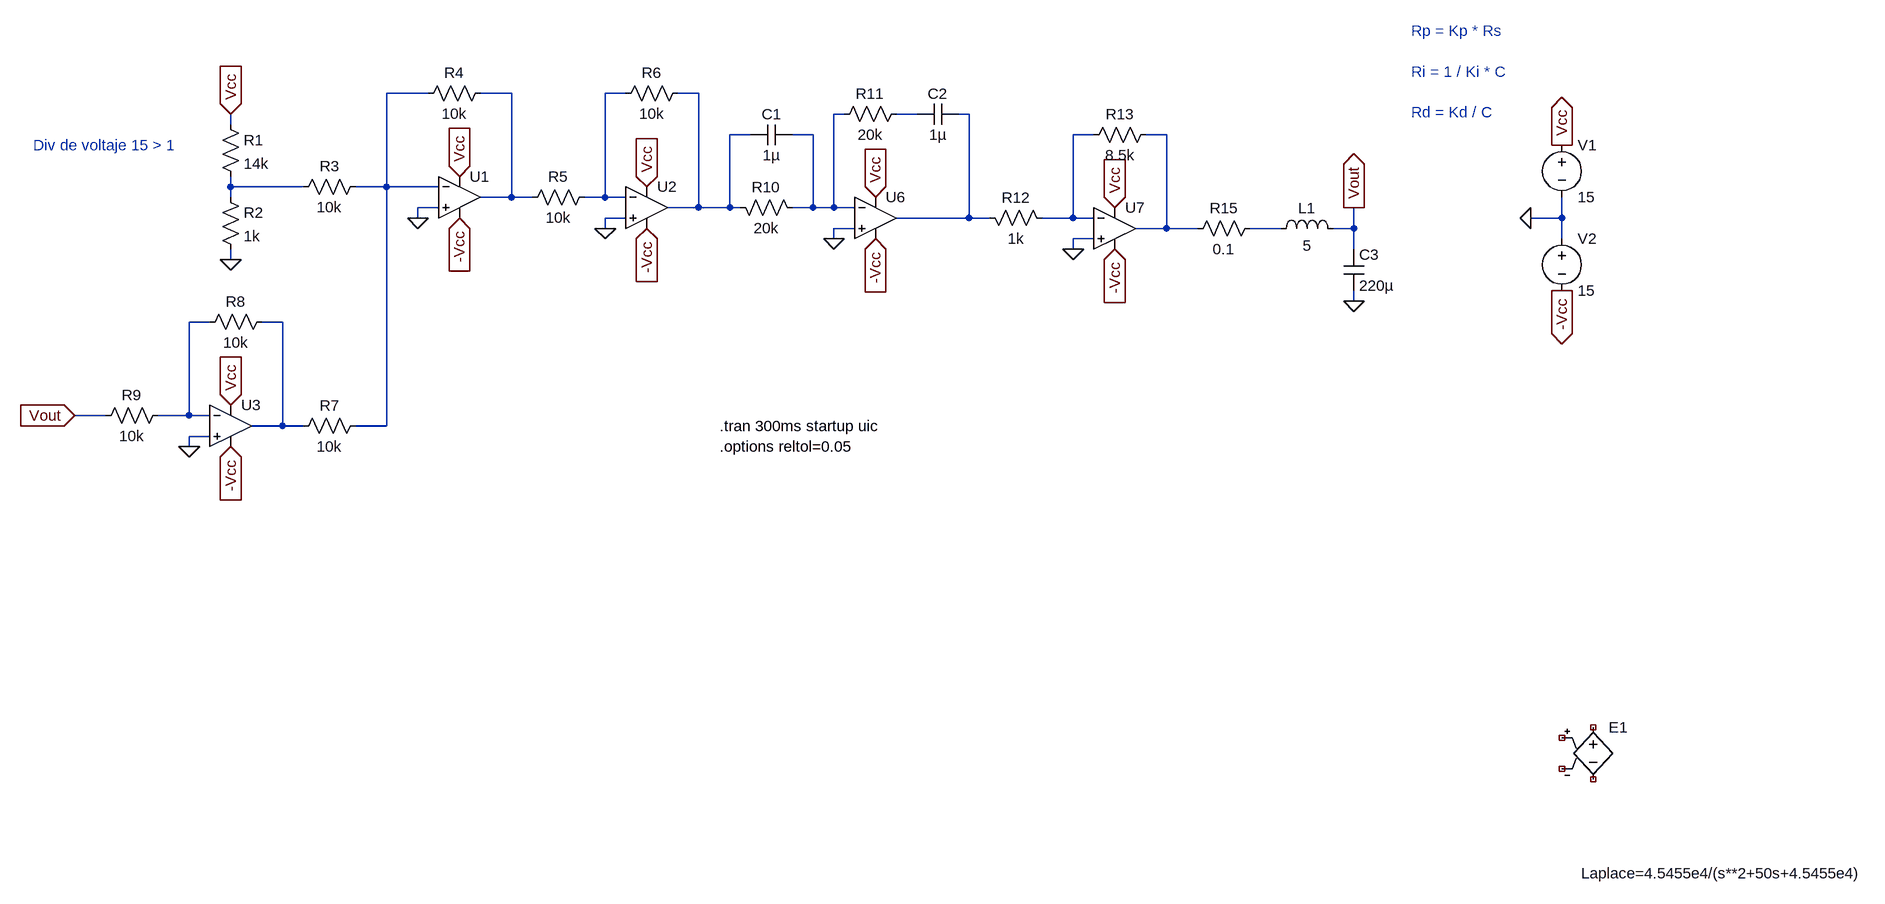
[diagram p0: schematic P05.asc]
P05.asc, the LTspice schematic file:
Version 4.1
SHEET 1 2524 780
WIRE 176 -464 112 -464
WIRE 304 -464 256 -464
WIRE 480 -464 448 -464
WIRE 592 -464 560 -464
WIRE 816 -432 800 -432
WIRE 928 -432 896 -432
WIRE 1008 -432 992 -432
WIRE -128 -416 -128 -432
WIRE 672 -400 640 -400
WIRE 768 -400 736 -400
WIRE 1200 -400 1168 -400
WIRE 1312 -400 1280 -400
WIRE -128 -320 -128 -336
WIRE -16 -320 -128 -320
WIRE 112 -320 112 -464
WIRE 112 -320 64 -320
WIRE 192 -320 112 -320
WIRE -128 -304 -128 -320
WIRE 304 -304 304 -464
WIRE 304 -304 256 -304
WIRE 336 -304 304 -304
WIRE 448 -304 448 -464
WIRE 448 -304 416 -304
WIRE 480 -304 448 -304
WIRE 192 -288 160 -288
WIRE 592 -288 592 -464
WIRE 592 -288 544 -288
WIRE 640 -288 640 -400
WIRE 640 -288 592 -288
WIRE 656 -288 640 -288
WIRE 768 -288 768 -400
WIRE 768 -288 736 -288
WIRE 800 -288 800 -432
WIRE 800 -288 768 -288
WIRE 832 -288 800 -288
WIRE 160 -272 160 -288
WIRE 480 -272 448 -272
WIRE 1008 -272 1008 -432
WIRE 1008 -272 896 -272
WIRE 1040 -272 1008 -272
WIRE 1168 -272 1168 -400
WIRE 1168 -272 1120 -272
WIRE 1200 -272 1168 -272
WIRE 1920 -272 1920 -304
WIRE 1920 -272 1872 -272
WIRE 448 -256 448 -272
WIRE 832 -256 800 -256
WIRE 1312 -256 1312 -400
WIRE 1312 -256 1264 -256
WIRE 1360 -256 1312 -256
WIRE 1488 -256 1440 -256
WIRE 1600 -256 1600 -288
WIRE 1600 -256 1568 -256
WIRE 800 -240 800 -256
WIRE 1200 -240 1168 -240
WIRE 1920 -240 1920 -272
WIRE 1168 -224 1168 -240
WIRE 1600 -224 1600 -256
WIRE -128 -208 -128 -224
WIRE 1600 -144 1600 -160
WIRE -160 -112 -192 -112
WIRE -48 -112 -80 -112
WIRE -320 32 -368 32
WIRE -192 32 -192 -112
WIRE -192 32 -240 32
WIRE -160 32 -192 32
WIRE -48 48 -48 -112
WIRE -48 48 -96 48
WIRE -16 48 -48 48
WIRE 112 48 112 -320
WIRE 112 48 64 48
WIRE -160 64 -192 64
WIRE -192 80 -192 64
FLAG 1872 -272 0
FLAG 1920 -384 Vcc
IOPIN 1920 -384 Out
FLAG 1920 -160 -Vcc
IOPIN 1920 -160 Out
FLAG 864 -304 Vcc
IOPIN 864 -304 In
FLAG 1232 -288 Vcc
IOPIN 1232 -288 In
FLAG -128 16 Vcc
IOPIN -128 16 In
FLAG 512 -320 Vcc
IOPIN 512 -320 In
FLAG 224 -336 Vcc
IOPIN 224 -336 In
FLAG 864 -240 -Vcc
IOPIN 864 -240 In
FLAG 1232 -224 -Vcc
IOPIN 1232 -224 In
FLAG -128 80 -Vcc
IOPIN -128 80 In
FLAG 512 -256 -Vcc
IOPIN 512 -256 In
FLAG 224 -272 -Vcc
IOPIN 224 -272 In
FLAG -128 -208 0
FLAG -128 -432 Vcc
IOPIN -128 -432 In
FLAG -192 80 0
FLAG 448 -256 0
FLAG 160 -272 0
FLAG 800 -240 0
FLAG 1168 -224 0
FLAG 1600 -144 0
FLAG 1600 -288 Vout
IOPIN 1600 -288 Out
FLAG -368 32 Vout
IOPIN -368 32 In
SYMBOL e 1968 496 R0
WINDOW 3 -18 241 Left 2
SYMATTR Value Laplace=4.5455e4/(s**2+50s+4.5455e4)
SYMATTR InstName E1
SYMBOL OpAmps\\UniversalOpAmp2 224 -304 R0
SYMATTR InstName U1
SYMBOL OpAmps\\UniversalOpAmp2 512 -288 R0
SYMATTR InstName U2
SYMBOL OpAmps\\UniversalOpAmp2 -128 48 R0
SYMATTR InstName U3
SYMBOL voltage 1920 -400 R0
WINDOW 123 0 0 Left 0
WINDOW 39 0 0 Left 0
SYMATTR InstName V1
SYMATTR Value 15
SYMBOL voltage 1920 -256 R0
WINDOW 123 0 0 Left 0
WINDOW 39 0 0 Left 0
SYMATTR InstName V2
SYMATTR Value 15
SYMBOL res -144 -432 R0
SYMATTR InstName R1
SYMATTR Value 14k
SYMBOL res -144 -320 R0
SYMATTR InstName R2
SYMATTR Value 1k
SYMBOL res 80 -336 R90
WINDOW 0 0 56 VBottom 2
WINDOW 3 32 56 VTop 2
SYMATTR InstName R3
SYMATTR Value 10k
SYMBOL res 272 -480 R90
WINDOW 0 0 56 VBottom 2
WINDOW 3 32 56 VTop 2
SYMATTR InstName R4
SYMATTR Value 10k
SYMBOL res 432 -320 R90
WINDOW 0 0 56 VBottom 2
WINDOW 3 32 56 VTop 2
SYMATTR InstName R5
SYMATTR Value 10k
SYMBOL res 576 -480 R90
WINDOW 0 0 56 VBottom 2
WINDOW 3 32 56 VTop 2
SYMATTR InstName R6
SYMATTR Value 10k
SYMBOL res 80 32 R90
WINDOW 0 0 56 VBottom 2
WINDOW 3 32 56 VTop 2
SYMATTR InstName R7
SYMATTR Value 10k
SYMBOL res -64 -128 R90
WINDOW 0 0 56 VBottom 2
WINDOW 3 32 56 VTop 2
SYMATTR InstName R8
SYMATTR Value 10k
SYMBOL res -224 16 R90
WINDOW 0 0 56 VBottom 2
WINDOW 3 32 56 VTop 2
SYMATTR InstName R9
SYMATTR Value 10k
SYMBOL res 752 -272 M270
WINDOW 0 32 56 VTop 2
WINDOW 3 0 56 VBottom 2
SYMATTR InstName R10
SYMATTR Value 20k
SYMBOL res 912 -448 R90
WINDOW 0 0 56 VBottom 2
WINDOW 3 32 56 VTop 2
SYMATTR InstName R11
SYMATTR Value 20k
SYMBOL res 1136 -256 M270
WINDOW 0 32 56 VTop 2
WINDOW 3 0 56 VBottom 2
SYMATTR InstName R12
SYMATTR Value 1k
SYMBOL res 1296 -416 R90
WINDOW 0 0 56 VBottom 2
WINDOW 3 32 56 VTop 2
SYMATTR InstName R13
SYMATTR Value 8.5k
SYMBOL cap 736 -416 R90
WINDOW 0 0 32 VBottom 2
WINDOW 3 32 32 VTop 2
SYMATTR InstName C1
SYMATTR Value 1µ
SYMBOL cap 992 -448 R90
WINDOW 0 0 32 VBottom 2
WINDOW 3 32 32 VTop 2
SYMATTR InstName C2
SYMATTR Value 1µ
SYMBOL OpAmps\\UniversalOpAmp 864 -272 R0
SYMATTR InstName U6
SYMATTR Value2 Avol=1Meg GBW=100Meg Vos=0
SYMBOL OpAmps\\UniversalOpAmp 1232 -256 R0
SYMATTR InstName U7
SYMATTR Value2 Avol=1Meg GBW=100Meg Vos=0
SYMBOL res 1456 -272 R90
WINDOW 0 0 56 VBottom 2
WINDOW 3 32 56 VTop 2
SYMATTR InstName R15
SYMATTR Value 0.1
SYMBOL ind 1472 -240 R270
WINDOW 0 32 56 VTop 2
WINDOW 3 5 56 VBottom 2
SYMATTR InstName L1
SYMATTR Value 5
SYMATTR SpiceLine Rser=1m
SYMBOL cap 1584 -224 R0
SYMATTR InstName C3
SYMATTR Value 220µ
TEXT 624 80 Left 2 !.options reltol=0.05
TEXT 624 48 Left 2 !.tran 300ms startup uic
TEXT 1688 -560 Left 2 ;Rp = Kp * Rs\n \nRi = 1 / Ki * C\n \nRd = Kd / C
TEXT -432 -384 Left 2 ;Div de voltaje 15 > 1

The netlist it stands for:
* P05.asc
E1 NC_01 NC_02 NC_03 NC_04 Laplace=4.5455e4/(s**2+50s+4.5455e4)
X§U1 0 N001 Vcc -Vcc N002 level2 Avol=1Meg GBW=10Meg Slew=10Meg Ilimit=25m Rail=0 Vos=0 En=0 Enk=0 In=0 Ink=0 Rin=500Meg  ; pins In+ In- V+ V- OUT
X§U2 0 N003 Vcc -Vcc N004 level2 Avol=1Meg GBW=10Meg Slew=10Meg Ilimit=25m Rail=0 Vos=0 En=0 Enk=0 In=0 Ink=0 Rin=500Meg  ; pins In+ In- V+ V- OUT
X§U3 0 N012 Vcc -Vcc N013 level2 Avol=1Meg GBW=10Meg Slew=10Meg Ilimit=25m Rail=0 Vos=0 En=0 Enk=0 In=0 Ink=0 Rin=500Meg  ; pins In+ In- V+ V- OUT
V1 Vcc 0 15
V2 0 -Vcc 15
R1 Vcc N010 14k
R2 N010 0 1k
R3 N001 N010 10k
R4 N002 N001 10k
R5 N003 N002 10k
R6 N004 N003 10k
R7 N001 N013 10k
R8 N013 N012 10k
R9 N012 Vout 10k
R10 N005 N004 20k
R11 N006 N005 20k
R12 N008 N007 1k
R13 N009 N008 8.5k
C1 N005 N004 1µ
C2 N007 N006 1µ
X§U6 0 N005 Vcc -Vcc N007 level1 Avol=1Meg GBW=100Meg Vos=0 En=0 Enk=0 In=0 Ink=0 Rin=500Meg  ; pins In+ In- V+ V- OUT
X§U7 0 N008 Vcc -Vcc N009 level1 Avol=1Meg GBW=100Meg Vos=0 En=0 Enk=0 In=0 Ink=0 Rin=500Meg  ; pins In+ In- V+ V- OUT
R15 N011 N009 0.1
L1 N011 Vout 5 Rser=1m
C3 Vout 0 220µ
.options reltol=0.05
.tran 300ms startup uic
* Rp = Kp * Rs
* Ri = 1 / Ki * C
* Rd = Kd / C
* Div de voltaje 15 > 1
.lib UniversalOpAmp2.lib
.lib UniversalOpAmp1.lib
.backanno
.end